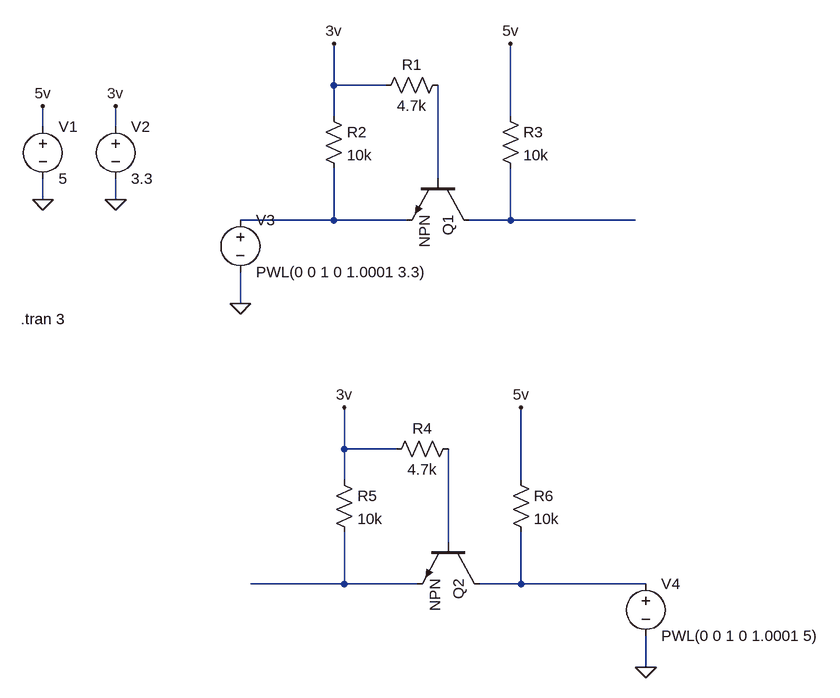
[diagram p0: schematic LevelShifter.asc]
LevelShifter.asc, the LTspice schematic file:
Version 4
SHEET 1 880 1044
WIRE 16 128 16 64
WIRE 96 128 16 128
WIRE 16 176 16 128
WIRE 288 176 288 64
WIRE -432 192 -432 160
WIRE -320 192 -320 160
WIRE 176 272 176 128
WIRE -432 304 -432 272
WIRE -320 304 -320 272
WIRE 16 336 16 256
WIRE 16 336 -128 336
WIRE 128 336 16 336
WIRE 288 336 288 256
WIRE 288 336 224 336
WIRE 480 336 288 336
WIRE -128 464 -128 416
WIRE 32 688 32 624
WIRE 112 688 32 688
WIRE 32 736 32 688
WIRE 304 736 304 624
WIRE 192 832 192 688
WIRE 32 896 32 816
WIRE 32 896 -112 896
WIRE 144 896 32 896
WIRE 304 896 304 816
WIRE 304 896 240 896
WIRE 496 896 304 896
WIRE 496 1024 496 976
FLAG -432 304 0
FLAG 288 64 5v
FLAG 16 64 3v
FLAG -320 304 0
FLAG -432 160 5v
FLAG -320 160 3v
FLAG -128 464 0
FLAG 304 624 5v
FLAG 32 624 3v
FLAG 496 1024 0
SYMBOL res 192 112 R90
WINDOW 0 0 56 VBottom 2
WINDOW 3 32 56 VTop 2
SYMATTR InstName R1
SYMATTR Value 4.7k
SYMBOL res 0 160 R0
SYMATTR InstName R2
SYMATTR Value 10k
SYMBOL res 272 160 R0
SYMATTR InstName R3
SYMATTR Value 10k
SYMBOL npn 224 272 R90
SYMATTR InstName Q1
SYMBOL voltage -432 176 R0
WINDOW 123 0 0 Left 2
WINDOW 39 0 0 Left 2
SYMATTR InstName V1
SYMATTR Value 5
SYMBOL voltage -320 176 R0
WINDOW 123 0 0 Left 2
WINDOW 39 0 0 Left 2
SYMATTR InstName V2
SYMATTR Value 3.3
SYMBOL voltage -128 320 R0
WINDOW 123 0 0 Left 2
WINDOW 39 0 0 Left 2
SYMATTR InstName V3
SYMATTR Value PWL(0 0 1 0 1.0001 3.3)
SYMBOL res 208 672 R90
WINDOW 0 0 56 VBottom 2
WINDOW 3 32 56 VTop 2
SYMATTR InstName R4
SYMATTR Value 4.7k
SYMBOL res 16 720 R0
SYMATTR InstName R5
SYMATTR Value 10k
SYMBOL res 288 720 R0
SYMATTR InstName R6
SYMATTR Value 10k
SYMBOL npn 240 832 R90
SYMATTR InstName Q2
SYMBOL voltage 496 880 R0
WINDOW 123 0 0 Left 2
WINDOW 39 0 0 Left 2
SYMATTR InstName V4
SYMATTR Value PWL(0 0 1 0 1.0001 5)
TEXT -466 488 Left 2 !.tran 3

The netlist it stands for:
* LevelShifter.asc
R1 N001 3v 4.7k
R2 3v N002 10k
R3 5v N003 10k
Q1 N003 N001 N002 0 NPN
V1 5v 0 5
V2 3v 0 3.3
V3 N002 0 PWL(0 0 1 0 1.0001 3.3)
R4 N004 3v 4.7k
R5 3v N005 10k
R6 5v N006 10k
Q2 N006 N004 N005 0 NPN
V4 N006 0 PWL(0 0 1 0 1.0001 5)
.model NPN NPN
.model PNP PNP
.lib standard.bjt
.tran 3
.backanno
.end